# EAGLE design Jerry_microMouse (EAGLE 9.5.2)
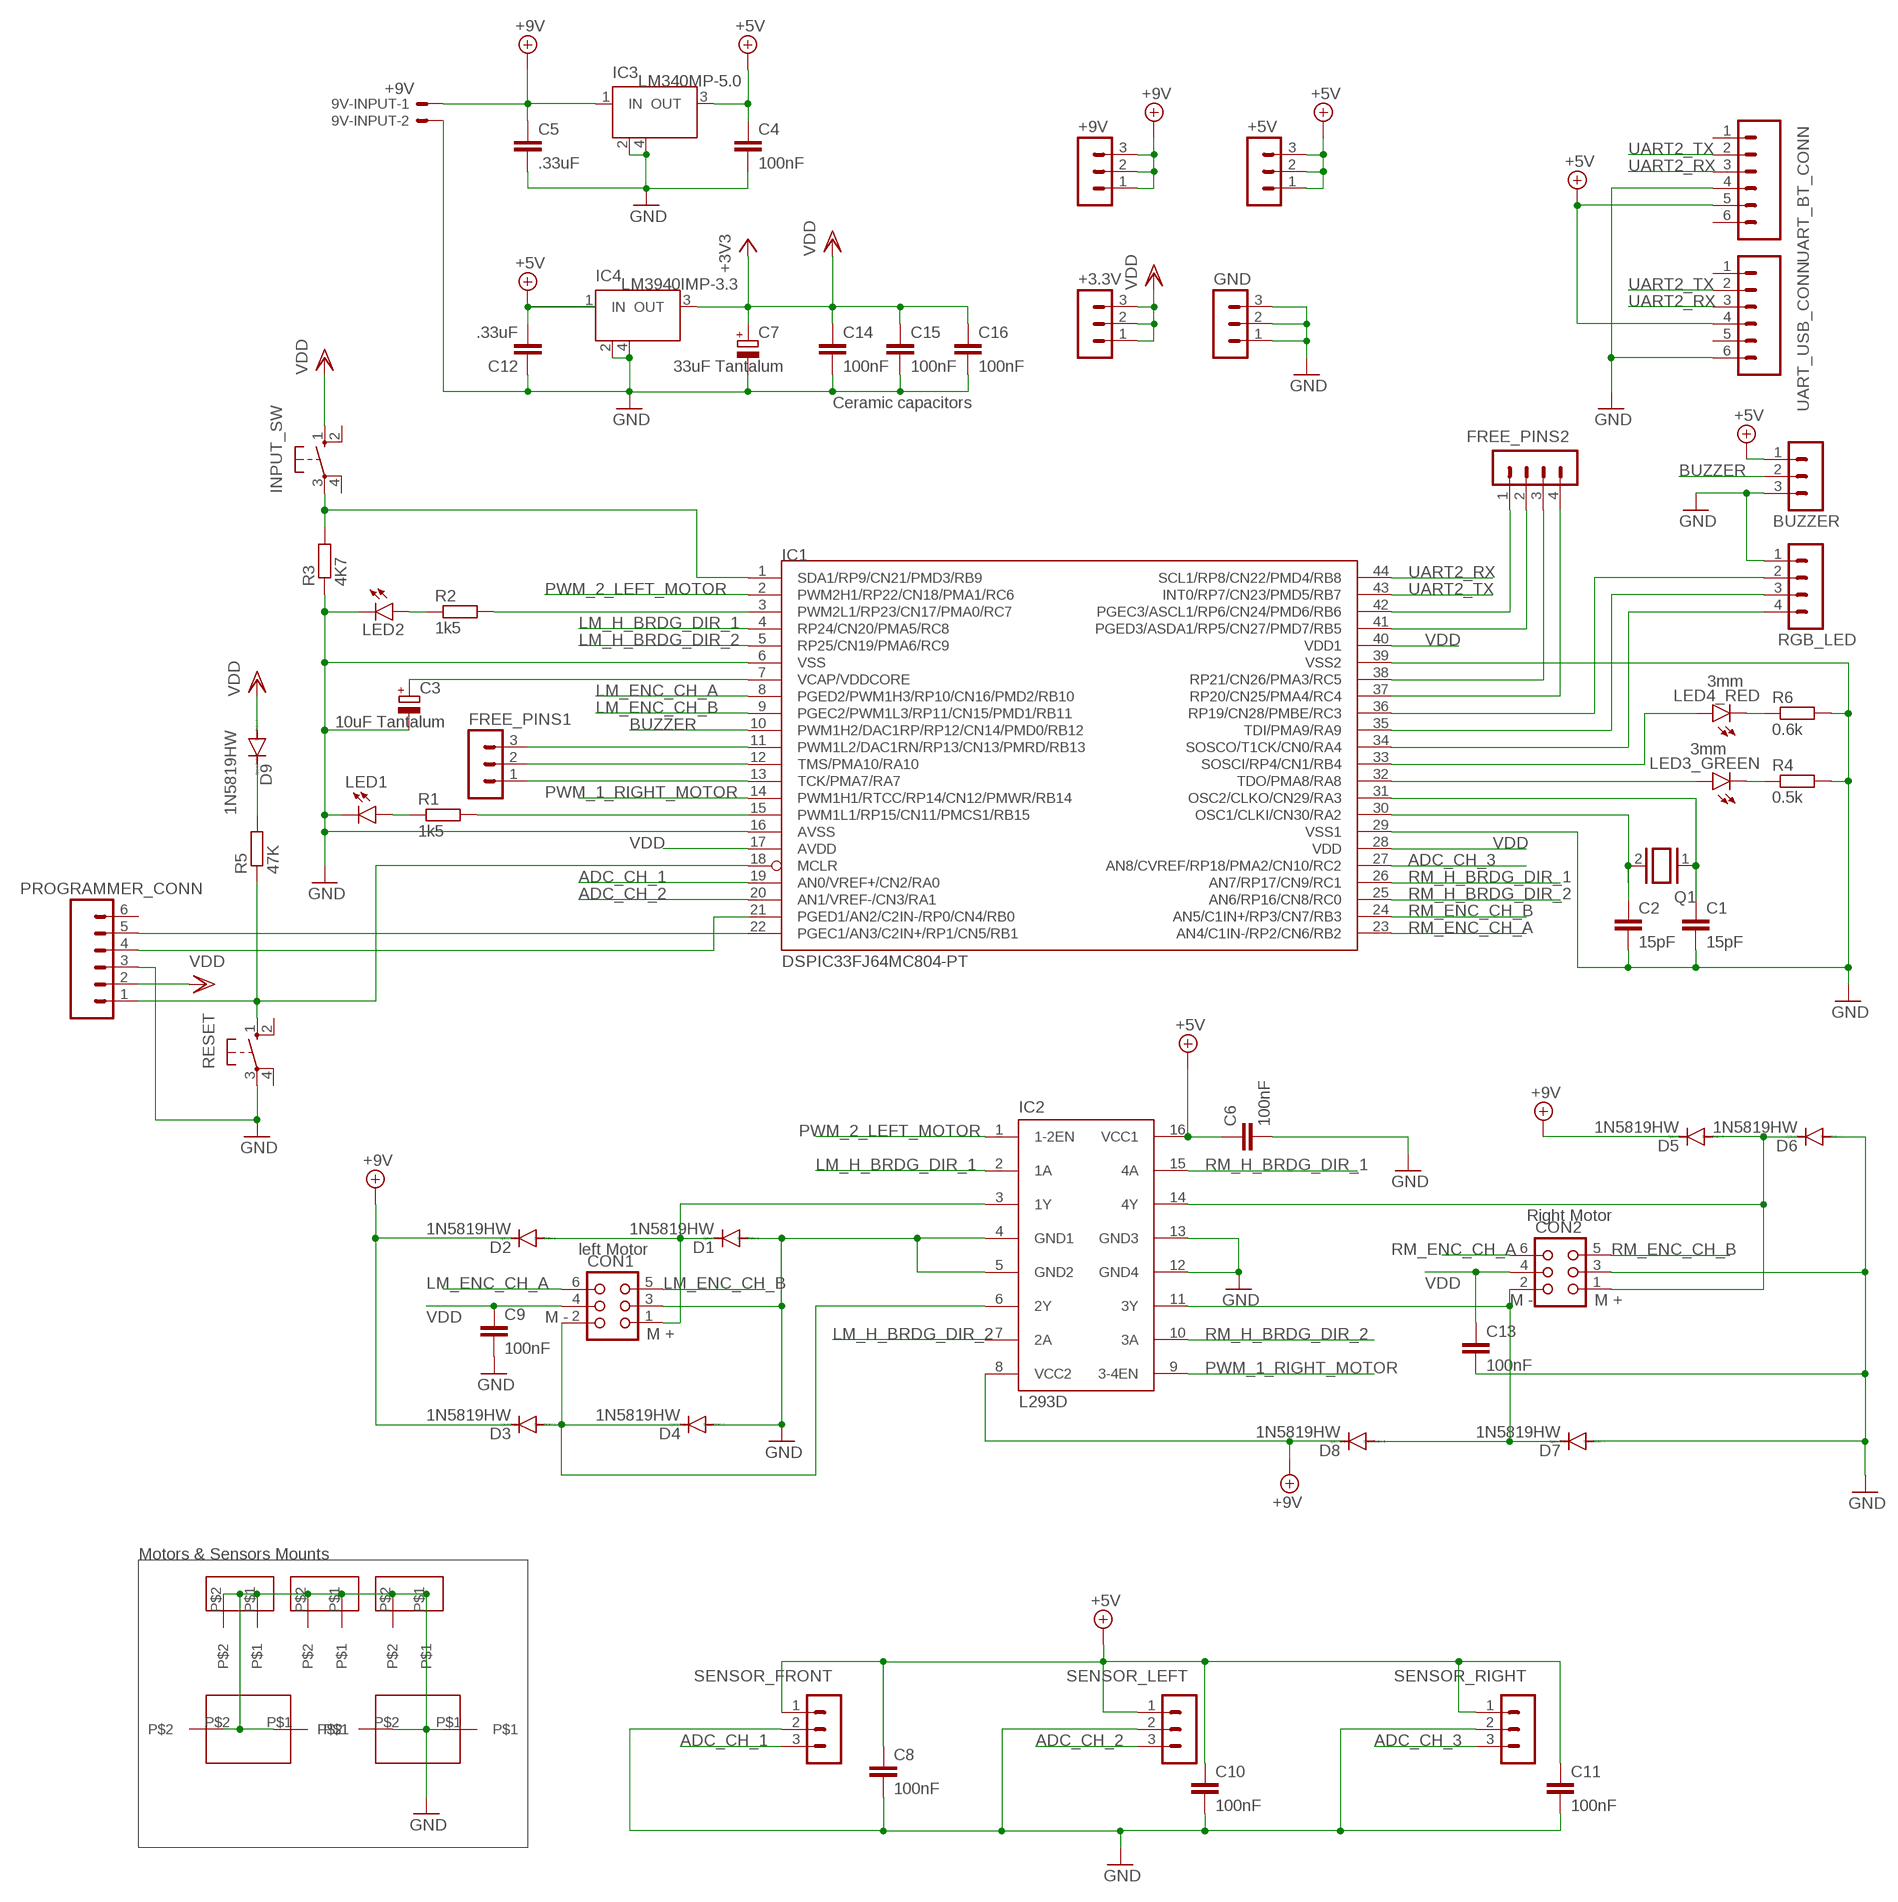
[diagram p0: schematic, sheet 1]

## Parts
9V-INPUT  +9V  22-23-2021  [22-23-2021]
+3.3V  MA03-1  [MA03-1]
+5V  MA03-1  [MA03-1]
+9V  MA03-1  [MA03-1]
BUZZER  MA03-1  [MA03-1]
C1  15pF  C-EUC0805  [C0805]
C2  15pF  C-EUC0805  [C0805]
C3  10uF Tantalum  CPOL-EUCT3216  [CT3216]
C4  100nF  C-EUC0805  [C0805]
C5  .33uF  C-EUC0805  [C0805]
C6  100nF  C-EUC0805  [C0805]
C7  33uF Tantalum  CPOL-EUCT7343  [CT7343]
C8  100nF  C-EUC0805  [C0805]
C9  100nF  C-EUC0805  [C0805]
C10  100nF  C-EUC0805  [C0805]
C11  100nF  C-EUC0805  [C0805]
C12  .33uF  C-EUC0805  [C0805]
C13  100nF  C-EUC0805  [C0805]
C14  100nF  C-EUC0805  [C0805]
C15  100nF  C-EUC0805  [C0805]
C16  100nF  C-EUC0805  [C0805]
CON1  CON06L  [CON06L]
CON2  CON06L  [CON06L]
D1  1N5819HW  CGRM4001-G  [SOD-123_MINI-SMA]
D2  1N5819HW  CGRM4001-G  [SOD-123_MINI-SMA]
D3  1N5819HW  CGRM4001-G  [SOD-123_MINI-SMA]
D4  1N5819HW  CGRM4001-G  [SOD-123_MINI-SMA]
D5  1N5819HW  CGRM4001-G  [SOD-123_MINI-SMA]
D6  1N5819HW  CGRM4001-G  [SOD-123_MINI-SMA]
D7  1N5819HW  CGRM4001-G  [SOD-123_MINI-SMA]
D8  1N5819HW  CGRM4001-G  [SOD-123_MINI-SMA]
D9  1N5819HW  CGRM4001-G  [SOD-123_MINI-SMA]
FREE_PINS1  MA03-1  [MA03-1]
FREE_PINS2  MA04-1  [MA04-1]
GND  MA03-1  [MA03-1]
IC1  DSPIC33FJ64MC804-PT  [TQFP44]
IC2  L293D  [DIL16]
IC3  LM340MP-5.0  LM340S  [SOT223]
IC4  LM3940IMP-3.3  LM340S  [SOT223]
INPUT_SW  10-XX  [B3F-10XX]
LED1  LED5MM  [LED5MM]
LED2  LED5MM  [LED5MM]
LED3_GREEN  3mm  LEDB155  [Q62902-B155]
LED4_RED  3mm  LEDB155  [Q62902-B155]
PROGRAMMER_CONN  M06  [06P]
Q1  XTAL/S  [QS]
R1  1k5  R-EU_R0805  [R0805]
R2  1k5  R-EU_R0805  [R0805]
R3  4K7  R-EU_R0805  [R0805]
R4  0.5k  R-EU_R0805  [R0805]
R5  47K  R-EU_R0805  [R0805]
R6  0.6k  R-EU_R0805  [R0805]
RESET  10-XX  [B3F-10XX]
RGB_LED  MA04-1  [MA04-1]
SENS_MNT_F  SENSOR_MOUNT_F  SENSOR_MOUNT  [SENSOR_MOUNT]
SENS_MNT_L  SENSOR_MOUNT_L  SENSOR_MOUNT  [SENSOR_MOUNT]
SENS_MNT_R  SENSOR_MOUNT_R  SENSOR_MOUNT  [SENSOR_MOUNT]
SENSOR_FRONT  MA03-1  [MA03-1]
SENSOR_LEFT  MA03-1  [MA03-1]
SENSOR_RIGHT  MA03-1  [MA03-1]
U$1  MOTOR_MOUNT  [MOTOR_MOUNT]
U$2  MOTOR_MOUNT  [MOTOR_MOUNT]
UART_BT_CONN  M06  [06P]
UART_USB_CONN  M06  [06P]

## Nets
+5V: +5V.1 +5V.2 +5V.3 BUZZER.1 C4.1 C6.1 C8.1 C10.1 C11.1 C12.2 IC2.16(VCC1) IC3.3(OUT) IC4.1(IN) SENSOR_FRONT.1 SENSOR_LEFT.1 SENSOR_RIGHT.1 UART_BT_CONN.5 UART_USB_CONN.4
+9V: 9V-INPUT.1 +9V.1 +9V.2 +9V.3 C5.1 D2.C D3.C D5.C D8.C IC2.8(VCC2) IC3.1(IN)
ADC_CH_1: IC1.19(AN0/VREF+/CN2/RA0) SENSOR_FRONT.3
ADC_CH_2: IC1.20(AN1/VREF-/CN3/RA1) SENSOR_LEFT.3
ADC_CH_3: IC1.27(AN8/CVREF/RP18/PMA2/CN10/RC2) SENSOR_RIGHT.3
BUZZER: BUZZER.2 IC1.10(PWM1H2/DAC1RP/RP12/CN14/PMD0/RB12)
GND: 9V-INPUT.2 BUZZER.3 C1.2 C2.2 C3.- C4.2 C5.2 C6.2 C7.- C8.2 C9.2 C10.2 C11.2 C12.1 C13.2 C14.2 C15.2 C16.2 CON1.3 CON2.3 D1.A D4.A D6.A D7.A GND.1 GND.2 GND.3 IC1.6(VSS) IC1.16(AVSS) IC1.29(VSS1) IC1.39(VSS2) IC2.4(GND1) IC2.5(GND2) IC2.12(GND4) IC2.13(GND3) IC3.2(GND) IC3.4(GND) IC4.2(GND) IC4.4(GND) LED1.K(C) LED2.K(C) PROGRAMMER_CONN.3 R3.1 R4.2 R6.2 RESET.3(P) RGB_LED.1 SENS_MNT_F.P$1 SENS_MNT_F.P$2 SENS_MNT_L.P$1 SENS_MNT_L.P$2 SENS_MNT_R.P$1 SENS_MNT_R.P$2 SENSOR_FRONT.2 SENSOR_LEFT.2 SENSOR_RIGHT.2 U$1.P$1 U$1.P$2 U$2.P$1 U$2.P$2 UART_BT_CONN.4 UART_USB_CONN.6
LM_ENC_CH_A: CON1.6 IC1.8(PGED2/PWM1H3/RP10/CN16/PMD2/RB10)
LM_ENC_CH_B: CON1.5 IC1.9(PGEC2/PWM1L3/RP11/CN15/PMD1/RB11)
LM_H_BRDG_DIR_1: IC1.4(RP24/CN20/PMA5/RC8) IC2.2(1A)
LM_H_BRDG_DIR_2: IC1.5(RP25/CN19/PMA6/RC9) IC2.7(2A)
LM_M+: CON1.1 D1.C D2.A IC2.3(1Y)
LM_M-: CON1.2 D3.A D4.C IC2.6(2Y)
N$1: IC1.3(PWM2L1/RP23/CN17/PMA0/RC7) R2.2
N$3: LED2.A R2.1
N$5: IC1.22(PGEC1/AN3/C2IN+/RP1/CN5/RB1) PROGRAMMER_CONN.5
N$8: IC1.1(SDA1/RP9/CN21/PMD3/RB9) INPUT_SW.3(P) R3.2
N$9: IC1.32(TDO/PMA8/RA8) LED3_GREEN.A
N$10: C2.1 IC1.30(OSC1/CLKI/CN30/RA2) Q1.2
N$11: C1.1 IC1.31(OSC2/CLKO/CN29/RA3) Q1.1
N$12: IC1.21(PGED1/AN2/C2IN-/RP0/CN4/RB0) PROGRAMMER_CONN.4
N$13: LED3_GREEN.K(C) R4.1
N$14: IC1.15(PWM1L1/RP15/CN11/PMCS1/RB15) R1.2
N$15: IC1.33(SOSCI/RP4/CN1/RB4) LED4_RED.A
N$16: IC1.34(SOSCO/T1CK/CN0/RA4) RGB_LED.4
N$17: LED1.A R1.1
N$18: IC1.35(TDI/PMA9/RA9) RGB_LED.3
N$19: D9.C R5.2
N$20: IC1.36(RP19/CN28/PMBE/RC3) RGB_LED.2
N$21: FREE_PINS1.3 IC1.11(PWM1L2/DAC1RN/RP13/CN13/PMRD/RB13)
N$22: FREE_PINS2.1 IC1.42(PGEC3/ASCL1/RP6/CN24/PMD6/RB6)
N$23: FREE_PINS2.2 IC1.41(PGED3/ASDA1/RP5/CN27/PMD7/RB5)
N$24: FREE_PINS2.3 IC1.38(RP21/CN26/PMA3/RC5)
N$25: LED4_RED.K(C) R6.1
N$26: FREE_PINS2.4 IC1.37(RP20/CN25/PMA4/RC4)
N$27: FREE_PINS1.2 IC1.12(TMS/PMA10/RA10)
N$28: FREE_PINS1.1 IC1.13(TCK/PMA7/RA7)
PWM_1_RIGHT_MOTOR: IC1.14(PWM1H1/RTCC/RP14/CN12/PMWR/RB14) IC2.9(3-4EN)
PWM_2_LEFT_MOTOR: IC1.2(PWM2H1/RP22/CN18/PMA1/RC6) IC2.1(1-2EN)
RESET: IC1.18(MCLR) PROGRAMMER_CONN.1 R5.1 RESET.1(S)
RM_ENC_CH_A: CON2.6 IC1.23(AN4/C1IN-/RP2/CN6/RB2)
RM_ENC_CH_B: CON2.5 IC1.24(AN5/C1IN+/RP3/CN7/RB3)
RM_H_BRDG_DIR_1: IC1.26(AN7/RP17/CN9/RC1) IC2.15(4A)
RM_H_BRDG_DIR_2: IC1.25(AN6/RP16/CN8/RC0) IC2.10(3A)
RM_M+: CON2.1 D5.A D6.C IC2.14(4Y)
RM_M-: CON2.2 D7.C D8.A IC2.11(3Y)
UART2_RX: IC1.44(SCL1/RP8/CN22/PMD4/RB8) UART_BT_CONN.3 UART_USB_CONN.3
UART2_TX: IC1.43(INT0/RP7/CN23/PMD5/RB7) UART_BT_CONN.2 UART_USB_CONN.2
VCAP/VDDCORE: C3.+ IC1.7(VCAP/VDDCORE)
VDD: +3.3V.1 +3.3V.2 +3.3V.3 C7.+ C9.1 C13.1 C14.1 C15.1 C16.1 CON1.4 CON2.4 D9.A IC1.17(AVDD) IC1.28(VDD) IC1.40(VDD1) IC4.3(OUT) INPUT_SW.1(S) PROGRAMMER_CONN.2 ; supply symbol labelled +3V3
Unconnected: INPUT_SW.2(S1) INPUT_SW.4(P1) PROGRAMMER_CONN.6 RESET.2(S1) RESET.4(P1) UART_BT_CONN.1 UART_BT_CONN.6 UART_USB_CONN.1 UART_USB_CONN.5

## Notes on the sheet
- Ceramic capacitors
- Right Motor
- left Motor
- M - | M +
- M -
- M +
- Motors & Sensors Mounts

## Library data of the parts
9V-INPUT = con-molex:22-23-2021: .100" (2.54mm) Center Header - 2 Pin; MF: MOLEX; MPN: 22-23-2021; OC_FARNELL: 1462926; OC_NEWARK: 25C3832
+3.3V +5V +9V BUZZER FREE_PINS1 GND SENSOR_FRONT SENSOR_LEFT SENSOR_RIGHT = con-lstb:MA03-1: PIN HEADER; OC_FARNELL: unknown; OC_NEWARK: unknown
C1 C2 C4-C6 C8-C16 = rcl:C-EU: CAPACITOR, European symbol; SPICEPREFIX: C
C3 C7 = rcl:CPOL-EU: POLARIZED CAPACITOR, European symbol; SPICEPREFIX: C
CON1 CON2 = con-harting:CON06L: CONNECTOR; OC_FARNELL: unknown; OC_NEWARK: unknown
D1-D9 = diode:CGRM400*-G: Molded plasitc,JEDEC SOD-123/Mini SMA Source: Comchip CGRM4001-G.pdf
FREE_PINS2 RGB_LED = con-lstb:MA04-1: PIN HEADER; OC_FARNELL: unknown; OC_NEWARK: unknown
IC1 = microchip-dspic33fjxxmc:DSPIC33FJ64MC804: dsPIC33FJ32MC302/304, dsPIC33FJ64MCX02/X04, AND dsPIC33FJ128MCX02/X04 High-Performance, 16-bit Digital Signal Controllers Package:44 Pin TQFP Operating Range: * Up to 40 MIPS operation (at 3.0V -3.6V): - Industrial temperature range (-40°C to +85°C) - Extended temperature range (-40°C to +125°C) High-Performance DSC CPU: * Modified Harvard architecture * C compiler optimized instruction set * 16-bit wide data path * 24-bit wide instructions * Linear program memory addressing up to 4M instruction words * Linear data memory addressing up to 64 Kbytes * 83 base instructions: mostly 1 word/1 cycle * Two 40-bit accumulators with rounding and saturation options * Flexible and powerful addressing modes: - Indirect - Modulo - Bit-Reversed * Software stack * 16 x 16 fractional/integer multiply operations * 32/16 and 16/16 divide operations * Single-cycle multiply and accumulate: - Accumulator write back for DSP operations - Dual data fetch * Up to ±16-bit shifts for up to 40-bit data Direct Memory Access (DMA): * 8-channel hardware DMA * Up to 2 Kbytes dual ported DMA buffer area (DMA RAM) to store data transferred via DMA: - Allows data transfer between RAM and a peripheral while CPU is executing code (no cycle stealing) * Most peripherals support DMA Timers/Capture/Compare/PWM: * Timer/Counters, up to five 16-bit timers: - Can pair up to make two 32-bit timers - One timer runs as a Real-Time Clock with an external 32.768 kHz oscillator - Programmable prescaler * Input Capture (up to four channels): - Capture on up, down or both edges - 16-bit capture input functions - 4-deep FIFO on each capture * Output Compare (up to four channels): - Single or Dual 16-bit Compare mode - 16-bit Glitchless PWM mode * Hardware Real-Time Clock/Calendar (RTCC): - Provides clock, calendar, and alarm functions Interrupt Controller: * 5-cycle latency * Up to 53 available interrupt sources * Up to three external interrupts * Seven programmable priority levels * Five processor exceptions Digital I/O: * Peripheral pin Select functionality * Up to 35 programmable digital I/O pins * Wake-up/Interrupt-on-Change for up to 31 pins * Output pins can drive from 3.0V to 3.6V * Up to 5V output with open drain configuration * All digital input pins are 5V tolerant * 4 mA sink on all I/O pins On-Chip Flash and SRAM: * Flash program memory (up to 128 Kbytes) * Data SRAM (up to 16 Kbytes) * Boot, Secure, and General Security for program Flash System Management: * Flexible clock options: - External, crystal, resonator, internal RC - Fully integrated Phase-Locked Loop (PLL) - Extremely low jitter PLL * Power-up Timer * Oscillator Start-up Timer/Stabilizer * Watchdog Timer with its own RC oscillator * Fail-Safe Clock Monitor * Reset by multiple sources Power Management: * On-chip 2.5V voltage regulator * Switch between clock sources in real time * Idle, Sleep, and Doze modes with fast wake-up Analog-to-Digital Converters (ADCs): * 10-bit, 1.1 Msps or 12-bit, 500 Ksps conversion: - Two and four simultaneous samples (10-bit ADC) - Up to nine input channels with auto-scanning - Conversion start can be manual or synchronized with one of four trigger sources - Conversion possible in Sleep mode - ±2 LSb max integral nonlinearity - ±1 LSb max differential nonlinearity Audio Digital-to-Analog Converter (DAC): - 16-bit Dual Channel DAC module - 100 Ksps maximum sampling rate - Second-Order Digital Delta-Sigma Modulator Comparator Module: * Two analog comparators with programmable input/output configuration CMOS Flash Technology: * Low-power, high-speed Flash technology * Fully static design * 3.3V (±10%) operating voltage * Industrial and Extended temperature * Low power consumption Motor Control Peripherals: * 6-channel 16-bit Motor Control PWM: - Three duty cycle generators - Independent or Complementary mode - Programmable dead-time and output polarity - Edge-aligned or center-aligned - Manual output override control - One Fault input - Trigger for ADC conversions - PWM frequency for 16-bit resolution (@ 40 MIPS) = 1220 Hz for Edge-Aligned mode, 610 Hz for Center-Aligned mode - PWM frequency for 11-bit resolution (@ 40 MIPS) = 39.1 kHz for Edge-Aligned mode, 19.55 kHz for Center-Aligned mode * 2-channel 16-bit Motor Control PWM: - One duty cycle generator - Independent or Complementary mode - Programmable dead time and output polarity - Edge-aligned or center-aligned - Manual output override control - One Fault input - Trigger for ADC conversions - PWM frequency for 16-bit resolution (@ 40 MIPS) = 1220 Hz for Edge-Aligned mode, 610 Hz for Center-Aligned mode - PWM frequency for 11-bit resolution (@ 40 MIPS) = 39.1 kHz for Edge-Aligned mode, 19.55 kHz for Center-Aligned mode * 2-Quadrature Encoder Interface module: - Phase A, Phase B, and index pulse input - 16-bit up/down position counter - Count direction status - Position Measurement (x2 and x4) mode - Programmable digital noise filters on inputs - Alternate 16-bit Timer/Counter mode - Interrupt on position counter rollover/underflow
IC2 = st-microelectronics:L293D: PUSH-PULL 4 CHANNEL DRIVER; MPN: L293D; OC_FARNELL: 9589619; OC_NEWARK: 56P8249
IC3 IC4 = linear:LM340S: 3-Terminal Positive Regulators Source: http://cache.national.com/ds/LM/LM340.pdf
INPUT_SW RESET = switch-omron:10-XX: OMRON SWITCH; MPN: B3F-1000; OC_FARNELL: 176432; OC_NEWARK: 36M3542
LED1 LED2 LED3_GREEN LED4_RED = led:LED: LED OSRAM: - CHIPLED LG R971, LG N971, LY N971, LG Q971, LY Q971, LO R971, LY R971 LH N974, LH R974 LS Q976, LO Q976, LY Q976 LO Q996 - Hyper CHIPLED LW Q18S LB Q993, LB Q99A, LB R99A - SideLED LS A670, LO A670, LY A670, LG A670, LP A670 LB A673, LV A673, LT A673, LW A673 LH A674 LY A675 LS A676, LA A676, LO A676, LY A676, LW A676 LS A679, LY A679, LG A679 - Hyper Micro SIDELED® LS Y876, LA Y876, LO Y876, LY Y876 LT Y87S - SmartLED LW L88C, LW L88S LB L89C, LB L89S, LG L890 LS L89K, LO L89K, LY L89K LS L896, LA L896, LO L896, LY L896 - TOPLED LS T670, LO T670, LY T670, LG T670, LP T670 LSG T670, LSP T670, LSY T670, LOP T670, LYG T670 LG T671, LOG T671, LSG T671 LB T673, LV T673, LT T673, LW T673 LH T674 LS T676, LA T676, LO T676, LY T676, LB T676, LH T676, LSB T676, LW T676 LB T67C, LV T67C, LT T67C, LS T67K, LO T67K, LY T67K, LW E67C LS E67B, LA E67B, LO E67B, LY E67B, LB E67C, LV E67C, LT E67C LW T67C LS T679, LY T679, LG T679 LS T770, LO T770, LY T770, LG T770, LP T770 LB T773, LV T773, LT T773, LW T773 LH T774 LS E675, LA E675, LY E675, LS T675 LS T776, LA T776, LO T776, LY T776, LB T776 LHGB T686 LT T68C, LB T68C - Hyper Mini TOPLED® LB M676 - Mini TOPLED Santana® LG M470 LS M47K, LO M47K, LY M47K Source: http://www.osram.convergy.de LUXEON: - LUMILED® LXK2-PW12-R00, LXK2-PW12-S00, LXK2-PW14-U00, LXK2-PW14-V00 LXK2-PM12-R00, LXK2-PM12-S00, LXK2-PM14-U00 LXK2-PE12-Q00, LXK2-PE12-R00, LXK2-PE12-S00, LXK2-PE14-T00, LXK2-PE14-U00 LXK2-PB12-K00, LXK2-PB12-L00, LXK2-PB12-M00, LXK2-PB14-N00, LXK2-PB14-P00, LXK2-PB14-Q00 LXK2-PR12-L00, LXK2-PR12-M00, LXK2-PR14-Q00, LXK2-PR14-R00 LXK2-PD12-Q00, LXK2-PD12-R00, LXK2-PD12-S00 LXK2-PH12-R00, LXK2-PH12-S00 LXK2-PL12-P00, LXK2-PL12-Q00, LXK2-PL12-R00 Source: www.luxeon.com KINGBRIGHT: KA-3528ASYC Source: www.kingbright.com
PROGRAMMER_CONN UART_BT_CONN UART_USB_CONN = con-amp-quick:M06: AMP QUICK CONNECTOR; OC_FARNELL: unknown; OC_NEWARK: unknown
Q1 = special:XTAL/S: CRYSTAL
R1-R6 = rcl:R-EU_: RESISTOR, European symbol; SPICEPREFIX: R
SENS_MNT_F SENS_MNT_L SENS_MNT_R = linear:SENSOR_MOUNT
U$1 U$2 = linear:MOTOR_MOUNT

## Board
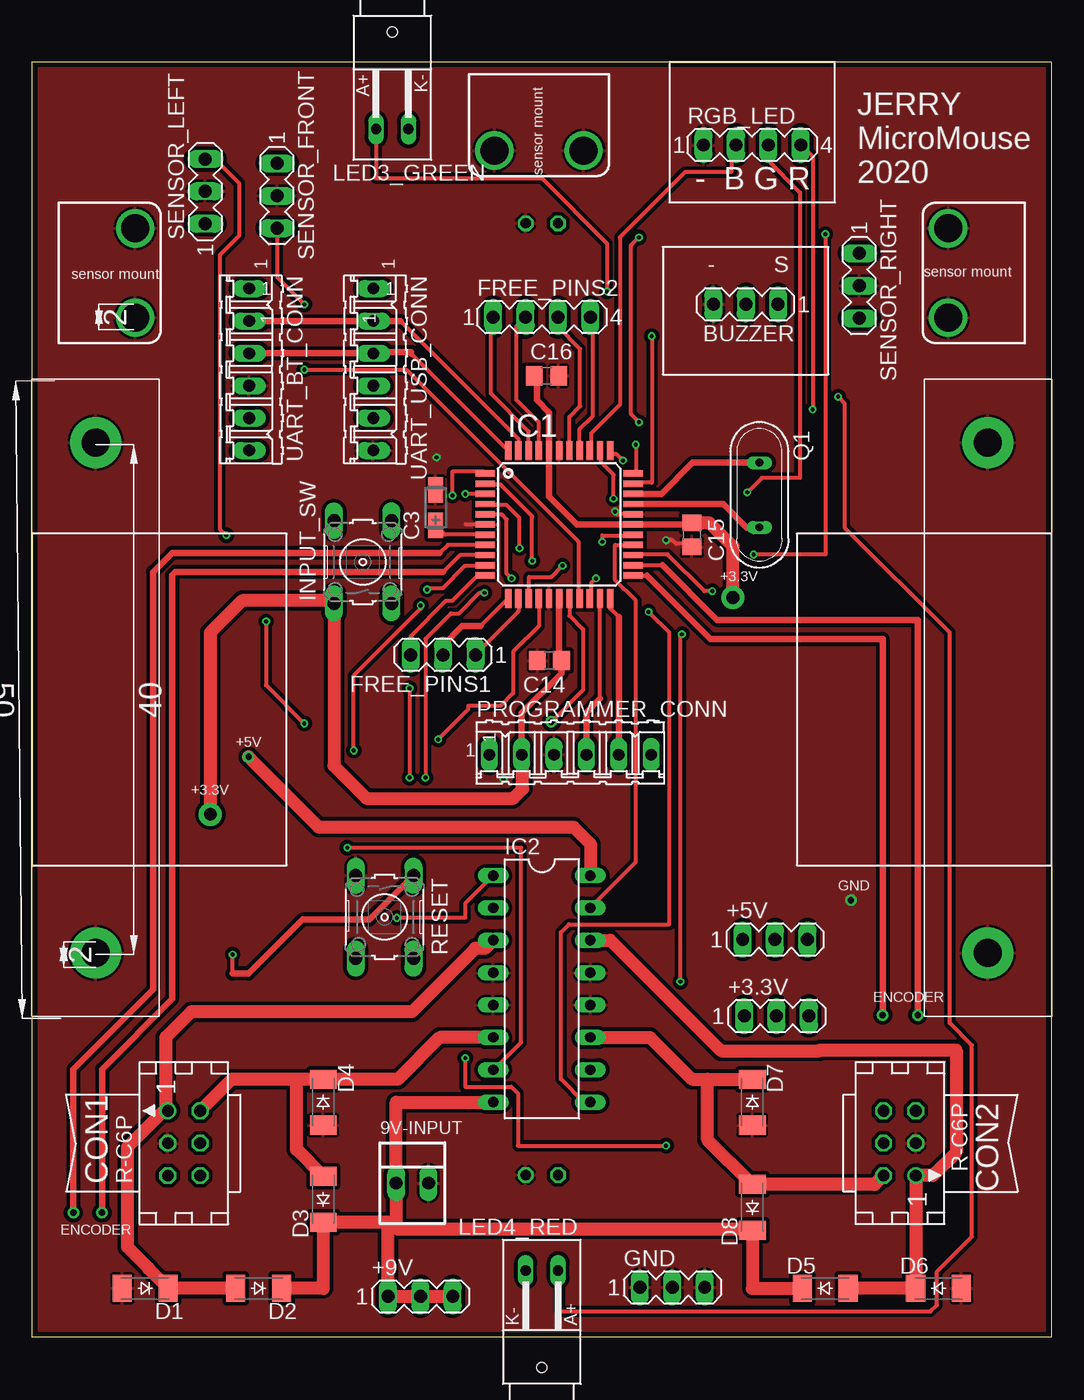
[diagram p1: board, top side]
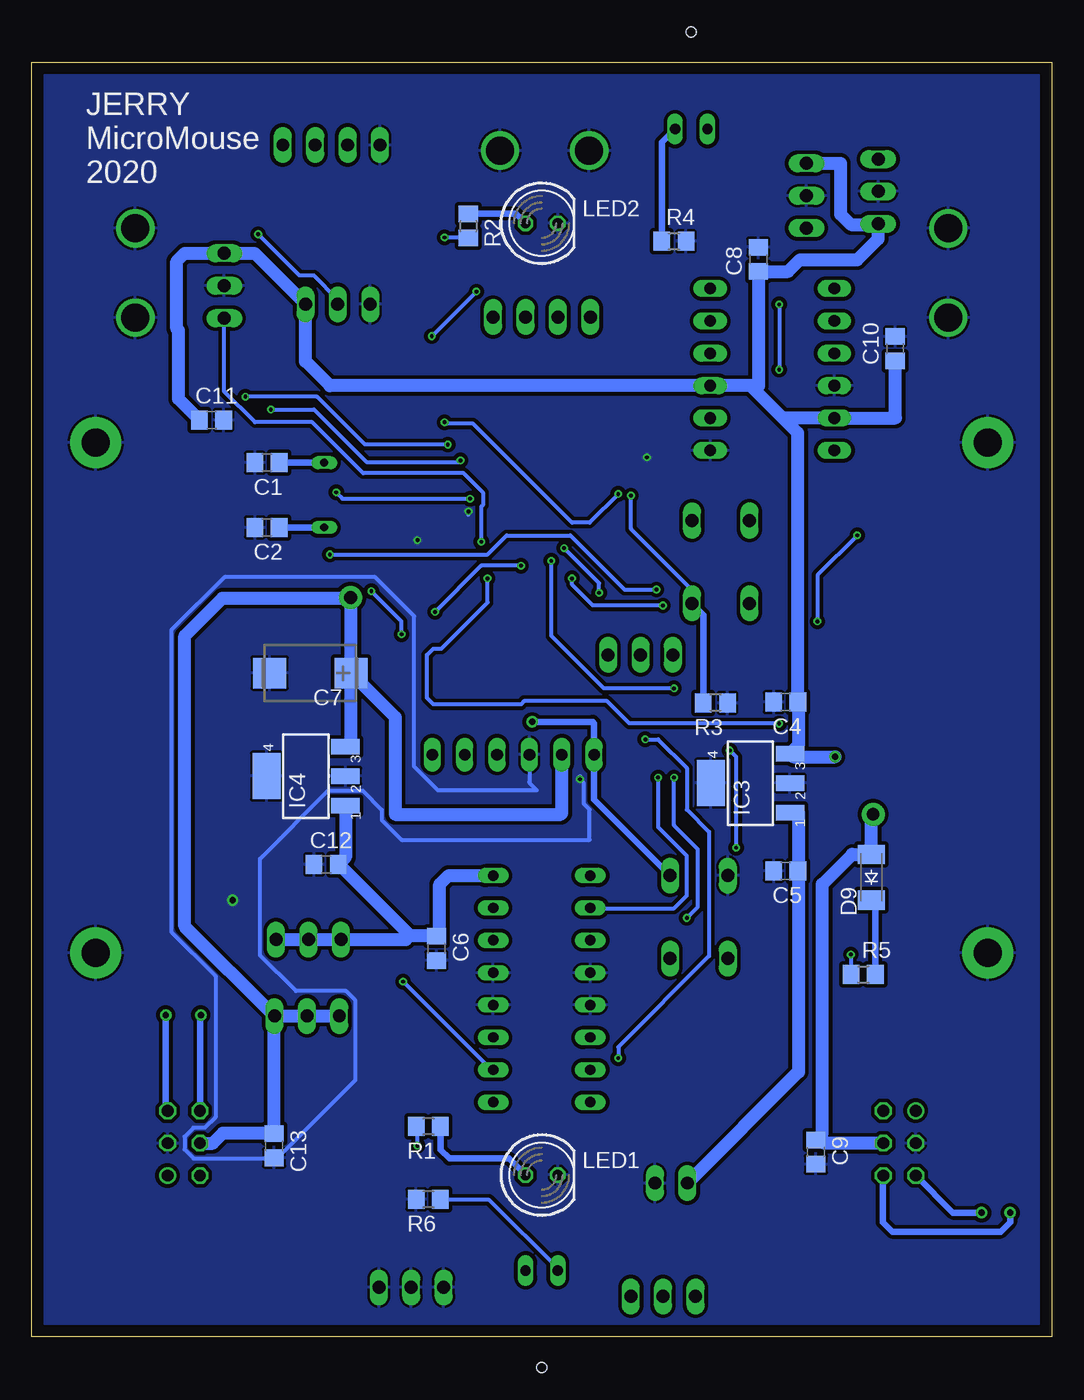
[diagram p2: board, bottom side, seen from below]

Size 80 x 100 mm. Coordinates in mm from the lower left corner, seen from the top.
Outline: 0,0 80,0 80,100 0,100 0,0
Copper layers (1*16): Top 0.035mm / dielectric 1.5mm / Bottom 0.035mm
Design rules "PCB-POOL Standard": minimum track width 0.15mm, minimum drill 0.3mm, track to track 0.15mm, track to pad 0.15mm, pad to pad 0.15mm, via to via 0.15mm, smd to smd 0.15mm, copper to edge 0.3mm, drill to drill 0.2mm, minimum pad ring 0.2mm, minimum via ring 0.15mm, stop-mask expansion 0.03mm, vias tented up to drill 0mil, thermal gap 0.2mm

### Footprints (pad centres in the part's own frame; a part is rotated, then mirrored left to right if it is on the bottom)
22-23-2021 = drill 1 long: 1 -1.27,0; 2 1.27,0
MA03-1 = drill 1.016 long: 1 -2.54,0; 2 0,0; 3 2.54,0
C0805 = smd 1.3 x 1.5: 1 -0.95,0; 2 0.95,0
CT3216 = smd 2 x 1.2: + -1.4,0; - 1.4,0
CT7343 = smd 2.6 x 2.4: + -3.2,0; - 3.2,0
CON06L = drill 0.914: 1 2.54,1.27 | drill 0.914 octagon: 2 2.54,-1.27; 3 0,1.27; 4 0,-1.27; 5 -2.54,1.27; 6 -2.54,-1.27
SOD-123_MINI-SMA = smd 1.5 x 2.1: A 1.8,0; C -1.8,0
MA04-1 = drill 1.016 long: 1 -3.81,0; 2 -1.27,0; 3 1.27,0; 4 3.81,0
TQFP44 = smd 1.5 x 0.5: 1 -5.8,4; 2 -5.8,3.2; 3 -5.8,2.4; 4 -5.8,1.6; 5 -5.8,0.8; 6 -5.8,0; 7 -5.8,-0.8; 8 -5.8,-1.6; 9 -5.8,-2.4; 10 -5.8,-3.2; 11 -5.8,-4; 23 5.8,-4; 24 5.8,-3.2; 25 5.8,-2.4; 26 5.8,-1.6; 27 5.8,-0.8; 28 5.8,0; 29 5.8,0.8; 30 5.8,1.6; 31 5.8,2.4; 32 5.8,3.2; 33 5.8,4 | smd 0.5 x 1.5: 12 -4,-5.8; 13 -3.2,-5.8; 14 -2.4,-5.8; 15 -1.6,-5.8; 16 -0.8,-5.8; 17 0,-5.8; 18 0.8,-5.8; 19 1.6,-5.8; 20 2.4,-5.8; 21 3.2,-5.8; 22 4,-5.8; 34 4,5.8; 35 3.2,5.8; 36 2.4,5.8; 37 1.6,5.8; 38 0.8,5.8; 39 0,5.8; 40 -0.8,5.8; 41 -1.6,5.8; 42 -2.4,5.8; 43 -3.2,5.8; 44 -4,5.8
DIL16 = drill 0.813 long: 1 -8.89,-3.81; 2 -6.35,-3.81; 3 -3.81,-3.81; 4 -1.27,-3.81; 5 1.27,-3.81; 6 3.81,-3.81; 7 6.35,-3.81; 8 8.89,-3.81; 9 8.89,3.81; 10 6.35,3.81; 11 3.81,3.81; 12 1.27,3.81; 13 -1.27,3.81; 14 -3.81,3.81; 15 -6.35,3.81; 16 -8.89,3.81
SOT223 = smd 1.219 x 2.235: 1 -2.311,-3.099; 2 0,-3.099; 3 2.311,-3.099 | smd 3.6 x 2.2: 4 0,3.099
B3F-10XX = drill 1.016 long: 1 -3.251,2.261; 2 3.251,2.261; 3 -3.251,-2.261; 4 3.251,-2.261
LED5MM = drill 0.813 octagon: A -1.27,0; K 1.27,0
Q62902-B155 = drill 0.813 long: A 7.62,-1.27; K 7.62,1.27 | hole 0.813: 0,0
06P = drill 0.914 long: 1 -6.35,0; 2 -3.81,0; 3 -1.27,0; 4 1.27,0; 5 3.81,0; 6 6.35,0
QS = drill 0.61 long: 1 -2.54,0; 2 2.54,0
R0805 = smd 1.3 x 1.5: 1 -0.95,0; 2 0.95,0
SENSOR_MOUNT = drill 2.2 pad 3: P$1 6,2; P$2 6,9
MOTOR_MOUNT = drill 2.2 pad 4: P$1 -19.86,0; P$2 20.14,0

### Placement (x,y rotation side)
9V-INPUT  29.84,12.06 0 top
+3.3V  58.42,25.17 0 top
+5V  58.3,31.18 0 top
+9V  30.48,3.17 0 top
BUZZER  56,81 180 top
C1  61.55,68.58 180 bottom
C2  61.55,63.5 180 bottom
C3  31.68,65.06 90 top
C4  20.86,49.8 180 bottom
C5  20.86,36.56 180 bottom
C6  48.26,30.48 270 bottom
C7  58.15,52.07 180 bottom
C8  23.02,84.53 90 bottom
C9  18.5,14.5 270 bottom
C10  12.28,77.53 90 bottom
C11  65.91,71.93 0 bottom
C12  56.92,37.06 0 bottom
C13  61,15 270 bottom
C14  40.6,53.07 180 top
C15  51.78,62.92 270 top
C16  40.37,75.39 0 top
CON1  11.93,15.2 90 top
CON2  68.08,15.2 270 top
D1  8.89,3.81 180 top
D2  17.78,3.81 180 top
D3  22.86,10.79 90 top
D4  22.86,18.41 270 top
D5  62.23,3.81 0 top
D6  71.12,3.81 0 top
D7  56.52,18.41 270 top
D8  56.52,10.16 90 top
D9  14.14,36.06 90 bottom
FREE_PINS1  32.25,53.5 180 top
FREE_PINS2  40,80 0 top
GND  50.24,3.88 0 top
IC1  41.37,63.73 0 top
IC2  40.01,27.3 270 top
IC3  23.63,43.45 90 bottom
IC4  58.5,44 90 bottom
INPUT_SW  25.95,60.78 90 top
LED1  40.01,12.7 0 bottom
LED2  40.01,87.36 0 bottom
LED3_GREEN  28.27,102.37 270 top
LED4_RED  40.01,-2.4 90 top
PROGRAMMER_CONN  42.23,45.68 0 top
Q1  57.07,66.04 270 top
R1  48.9,16.51 180 bottom
R2  45.77,87.14 270 bottom
R3  26.38,49.74 180 bottom
R4  29.63,85.94 0 bottom
R5  14.78,28.44 0 bottom
R6  48.9,10.79 180 bottom
RESET  27.67,32.94 270 top
RGB_LED  56.5,93.5 0 top
SENS_MNT_F  77.88,88.96 180 top
SENS_MNT_L  34.28,99.06 270 top
SENS_MNT_R  2.11,77.96 0 top
SENSOR_FRONT  19.23,89.52 270 top
SENSOR_LEFT  13.61,89.86 90 top
SENSOR_RIGHT  64.91,82.45 270 top
U$1  5,50 90 top
U$2  75,50 90 top
UART_BT_CONN  17.05,75.89 270 top
UART_USB_CONN  26.79,75.89 270 top

### Tracks (layer width: path | path; a pad name or v marks a point on that pad's centre or on a via)
+5V  (via drill 0.5)
  Top 1.016: v17,45.5 22.5,40 42.5,40 43.81,38.69 IC2.16
  Bottom 0.3: C6.1 48.38,31.5 48,31.75 | 19.85,49.38 19.88,49.38 C4.1 | C12.2 56,37.12 55.91,37.06 | C8.1 23.12,83.62 23,83.52
  Bottom 1.016: 19.85,49.38 19.85,46.44 IC3.3 20.27,45.5 v17,45.5 | C4.1 19.91,70.91 21.08,72.08 | 23.62,74.62 23,74.62 23,83.52 | 23.62,74.62 UART_USB_CONN.4 56.62,74.62 58.54,76.54 BUZZER.1 62.53,85 SENSOR_RIGHT.1 68,85 68.63,84.37 68.63,79.08 68.5,78.95 68.5,73.58 C11.1 | 21.08,72.08 23.62,74.62 | 21.08,72.08 UART_BT_CONN.5 12.25,72.08 12.25,76.55 C10.1 | SENSOR_FRONT.1 16.56,92.06 16.56,88.06 15.75,87.25 13.68,87.25 SENSOR_LEFT.1 13.61,86.14 15.25,84.5 19.75,84.5 20.68,83.58 C8.1 | IC4.1 55.4,37.63 55.91,37.12 55.91,37.06 50.34,31.49 | 50.34,31.49 48.26,31.49 48,31.75 48,35.5 47.3,36.2 IC2.16 | +5V.3 +5V.2 +5V.1 50.65,31.18 50.34,31.49
+9V
  Top 0.3: 30.5,3.17 30.5,3.25 +9V.2
  Top 1.016: 9V-INPUT.1 28.57,18.41 IC2.8 | 9V-INPUT.1 28.57,8.99 27.94,8.99 | 27.94,8.99 D3.C 22.86,3.81 D2.C | 27.94,8.99 +9V.1 +9V.2 30.5,3.17 +9V.3 | 9V-INPUT.1 28.57,8.5 56.52,8.5 D8.C 56.52,3.81 D5.C
  Bottom 0.3: C5.1 20,36.62 19.85,36.62
  Bottom 1.016: IC3.1 19.85,41.14 19.85,36.62 19.85,20.79 9V-INPUT.1
ADC_CH_1  (via drill 0.3)
  Top 0.3: v21.38,75.88 29.38,75.88 42.88,62.38 42.88,58 IC1.19 | v21.38,81 19.25,83.12 19.25,86.88 SENSOR_FRONT.3
  Bottom 0.3: v21.38,81 v21.38,75.88
ADC_CH_2  (via drill 0.3)
  Top 0.3: v44.25,59.5 43.88,59.12 43.88,58 IC1.20 | v21.38,48.12 18.38,51.12 v18.38,56.12 | v15.25,62.88 14.75,63.38 14.75,84.88 16.25,86.38 16.25,90.5 14.25,92.5 13.71,92.5 SENSOR_LEFT.3
  Bottom 0.3: v44.25,59.5 44.25,57.62 47.88,54 48.5,54 49,53.5 49,50.12 48.5,49.62 41.62,49.62 41.38,49.88 34.88,49.88 33.12,48.12 v21.38,48.12 | v18.38,56.12 18.38,59.75 v15.25,62.88
ADC_CH_3  (via drill 0.3)
  Top 0.3: v44.75,62.38 44.75,62.88 47.12,62.88 IC1.27
  Bottom 0.3: v44.75,62.38 44.75,65.12 44.62,65.25 44.62,66.25 46.12,67.75 54,67.75 58,71.75 62.5,71.75 64.91,74.16 SENSOR_RIGHT.3
BUZZER  (via drill 0.3)
  Top 0.3: v31,58.62 31,58.75 32.25,58.75 34,60.5 35.5,60.5 IC1.10 | v56.62,61.38 62.25,61.38 v62.25,86.5
  Bottom 0.3: v31,58.62 33.5,58.62 37.75,62.88 42.75,62.88 44.25,61.38 v56.62,61.38 | v62.25,86.5 59,83.25 57.88,83.25 56,81.38 BUZZER.2
GND  (via drill 0.3, 0.5)
  Top 0.3: C14.2 39.75,53.12 39.73,53.15 | IC1.29 45.97,64.53 v45.75,64.75 | C3.- 31.68,66.08
  Top 0.305: IC1.6 34.02,63.73 | C15.2 51.53,62.22 50.53,62.22 50.25,62.5 v49.75,62.5
  Bottom 0.3: 37,44 37.12,43.88 v37,43.75 36.69,43.44 36.69,41.81 36.25,41.37 36.25,39 51,39 52.56,40.56 52.56,41.35 54.06,42.85 56.75,42.85 62.1,37.5 62.1,29.95 59.29,27.14 55.36,27.14 54.62,26.4 54.62,20.15 60.78,13.99 67.31,13.99 68.02,14.7 68.02,15.7 67.31,16.41 66.44,16.41 65.6,17.24 65.6,28.31 69.06,31.77 69.06,55.44 64.9,59.6 53.06,59.6 50,56.54 50,44.73 48.14,42.88 40.38,42.88 41,43.5 40.97,43.53 PROGRAMMER_CONN.3
  Bottom 0.305: v45.75,64.75 45.75,64.5
  other vias: 31.75,69 64.25,34.25
  pour Bottom (isolate 0.3): 1,1 79,1 79,99 1,99
  pour Top (isolate 0.3): 0.5,0.5 79.5,0.5 79.5,99.5 0.5,99.5
LM_ENC_CH_A  (via drill 0.5)
  Top 0.3: IC1.8 32.63,62.13 32,61.5
  Top 0.508: 32,61.5 11,61.5 9.5,60 9.5,27.25 3.25,21 v3.25,9.75
  Bottom 0.508: v3.25,9.75 3.25,9 4,8.25 12.5,8.25 13.25,9 13.25,12.61 CON1.6
LM_ENC_CH_B  (via drill 0.5)
  Top 0.3: IC1.9 33.58,61.33 32.25,60
  Top 0.508: 32.25,60 11.25,60 11,59.75 11,26.5 5.5,21 v5.5,9.75
  Bottom 0.508: CON1.5 7.75,9.75 v5.5,9.75
LM_H_BRDG_DIR_1  (via drill 0.3)
  Top 0.3: v38.25,61.88 38.25,64.25 37.25,65.25 35.62,65.25 IC1.4 | v35.5,58.38 35.12,58.38 33.5,56.75 32.88,56.75 30.88,54.75 v30.88,43.88
  Bottom 0.3: v38.25,61.88 35.5,59.12 v35.5,58.38 | v30.88,43.88 30.88,40 28.62,37.75 28.62,34.62 29.62,33.62 36.12,33.62 IC2.2
LM_H_BRDG_DIR_2  (via drill 0.3)
  Top 0.3: v37.62,59.5 37.25,59.88 37.25,64.12 36.88,64.5 35.62,64.5 IC1.5 | v30.5,57.38 30.5,57.12 25.25,51.88 v25.25,46 | v24.75,38.38 38.38,38.38 38.38,23.12 36.25,21 IC2.7
  Bottom 0.3: v37.62,59.5 37.62,59 36,57.38 v30.5,57.38 | v25.25,46 24.75,45.5 v24.75,38.38
LM_M+
  Top 1.016: IC2.3 35.57,30.49 34.8,30.49 29.81,25.5 12.5,25.5 10.5,23.5 10.5,17.9 | 10.5,17.9 CON1.1 | D2.A D1.C 9.15,5.35 9.15,5.4 7.5,7.05 7.5,14.9 10.5,17.9
LM_M-
  Top 0.3: 21.12,20.21 21.12,14.25 22.75,12.62 D3.A
  Top 1.016: IC2.6 32,23.5 28.71,20.21 D4.C 21.12,20.21 20.75,20.21 | 20.75,20.21 15.68,20.21 CON1.2 | D3.A 20.75,14.71 20.75,20.21
N$1  (via drill 0.3)
  Top 0.3: v47.62,86.25 47,85.62 47,72.38 v47.62,71.75 | v34,66.12 35.5,66.12 IC1.3
  Bottom 0.3: v47.62,86.25 45.88,86.25 R2.2 | v47.62,71.75 47.5,71.62 45.38,71.62 37.62,63.88 36.25,63.88 v34,66.12
N$3
  Bottom 0.508: LED2.A 42.01,88.09 R2.1
N$5
  Top 0.3: IC1.22 45.37,57.13 46.05,56.45
  Top 0.508: PROGRAMMER_CONN.5 46.05,56.45
N$8  (via drill 0.3)
  Top 0.3: IC1.1 35.42,67.88 33,67.88 v33,66
  Bottom 0.3: v33,66 33,63.38 28.25,58.62 28.25,57.75 INPUT_SW.3
  Bottom 0.508: R3.2 27.32,56.64 INPUT_SW.3
N$9  (via drill 0.3)
  Top 0.3: v48.62,78.5 48.62,67 47.25,67 IC1.32 | v45.12,82 45.12,85.75 40,90.88 27,90.88 LED3_GREEN.A
  Bottom 0.3: v45.12,82 v48.62,78.5
N$10
  Top 0.508: IC1.30 54.24,65.33 56.07,63.5 Q1.2
  Bottom 0.508: Q1.2 C2.1
N$11
  Top 0.508: IC1.31 49.38,66.13 51.83,68.58 Q1.1
  Bottom 0.508: Q1.1 C1.1
N$12
  Top 0.3: 44.57,50.07 IC1.21
  Top 0.508: PROGRAMMER_CONN.4 43.51,47.74 43.5,47.75 43.5,49 44.57,50.07
N$13
  Bottom 0.508: R4.1 30.58,93.71 LED3_GREEN.K
N$14  (via drill 0.3)
  Top 0.3: IC1.15 39.77,55.77 37.75,53.75 37.75,50.5 36.75,49.5 34.25,49.5 34.25,49.25 v31.88,46.88 | v49.75,15 38.12,15 38.12,19.12 37.62,19.62 34,19.62 v34,21.88
  Bottom 0.3: v49.75,15 49.75,16.5 R1.2 | v34,21.88 34,22.75 26.88,29.88 26.88,39.62 28.62,41.38 28.62,44.62 30.88,46.88 v31.88,46.88
N$15  (via drill 0.3)
  Top 0.3: v47.38,70 47.38,67.88 47.25,67.75 IC1.33 | LED4_RED.A 41.38,5.12 41.38,2 70.5,2 71,2.5 71,5.12 73.75,7.88 73.75,22.88 72,24.62 72,55.25 63.75,63.5 63.75,73.25 v63.25,73.75
  Bottom 0.3: v47.38,70 53.88,70 57.62,73.75 v63.25,73.75
N$16  (via drill 0.3)
  Top 0.3: v46.38,68.75 45.88,69.25 45.62,69.25 45.38,69.5 IC1.34 | v61.25,72.75 61.25,92.56 RGB_LED.4
  Bottom 0.3: v46.38,68.75 46.5,68.62 53.75,68.62 57.88,72.75 v61.25,72.75
N$17
  Bottom 0.508: LED1.A 42.58,14 47.25,14 47.95,14.7 R1.1
N$18  (via drill 0.3)
  Top 0.3: v45.62,65.75 45.62,67.62 44.62,68.62 44.62,69.5 IC1.35 | v56.12,66.25 57.25,67.38 60.25,67.38 60.25,89.77 57.77,92.25 RGB_LED.3
  Bottom 0.3: v45.62,65.75 55.62,65.75 v56.12,66.25
N$19
  Bottom 0.508: R5.2 13.83,33.95 D9.C
N$20
  Top 0.3: IC1.36 43.88,69.62 43.88,70.88 46.12,73.12 46.12,86.25 51.25,91.38 54.88,91.38 54.88,93.25 55.12,93.5 RGB_LED.2
N$21
  Top 0.3: IC1.11 35.55,59.75 35,59.75 33,57.75 32.5,57.75 29.71,54.96 FREE_PINS1.3
N$22
  Top 0.3: IC1.42 38.97,71.03 36,74 36,79.81
  Top 0.508: 36,79.81 FREE_PINS2.1
N$23
  Top 0.3: IC1.41 39.77,71.73 38,73.5 38,79.27 FREE_PINS2.2
N$24
  Top 0.3: IC1.38 42.17,72.17 43,73 43,77.5 41.27,79.23
  Top 0.508: 41.27,79.23 FREE_PINS2.3
N$25
  Bottom 0.3: R6.1 47.88,10.75 44.12,10.75 38.62,5.25 LED4_RED.K
N$26
  Top 0.3: IC1.37 42.97,71.22 44,72.25 44,79.81
  Top 0.508: 44,79.81 FREE_PINS2.4
N$27
  Top 0.3: IC1.12 35.19,55.75
  Top 0.508: 35.19,55.75 33.75,55.75 32.25,54.25 FREE_PINS1.2
N$28
  Top 0.3: IC1.13 38.17,56.92 34.79,53.54
  Top 0.508: 34.79,53.54 FREE_PINS1.1
PWM_1_RIGHT_MOTOR  (via drill 0.3)
  Top 0.3: v48.38,56.88 50,55.25 50,32.38 42.12,32.38 41.5,31.75 41.5,20.23 43.31,18.41 IC2.9 | v41.62,60.5 40.75,59.62 39,59.62 39,58.12 IC1.14
  Bottom 0.3: v48.38,56.88 44.75,60.5 v41.62,60.5
PWM_2_LEFT_MOTOR  (via drill 0.3)
  Top 0.3: v39.25,60.88 39.25,64.38 36.75,66.88 35.62,66.88 IC1.2 | v29.62,50.88 v29.62,43.88 | v28.62,32.88 34,32.88 34,34 IC2.1
  Bottom 0.3: v39.25,60.88 39.25,55 35.12,50.88 v29.62,50.88 | v29.62,43.88 29.62,40.12 27.75,38.25 27.75,33.75 v28.62,32.88
RESET  (via drill 0.3, 0.5)
  Top 0.3: v40.75,48.25 43.25,50.75 43.25,55.5 42.17,56.58 IC1.18 | 15.75,28.5 v15.75,30
  Top 0.508: RESET.1 26.49,32.75 21.25,32.75 17,28.5 15.75,28.5
  Bottom 0.3: v15.75,30 15.75,28.5 R5.1
  Bottom 0.508: v40.75,48.25 36,48.25 35.88,48.13 PROGRAMMER_CONN.1 35.88,42.15 RESET.1
RM_ENC_CH_A  (via drill 0.5)
  Top 0.3: IC1.23 48.27,59.73
  Top 0.508: v66.75,25.25 66.75,54.75 53.25,54.75 48.27,59.73
  Bottom 0.508: v66.75,25.25 66.81,25.19 CON2.6
RM_ENC_CH_B  (via drill 0.5)
  Top 0.3: IC1.24 49.47,60.53
  Top 0.508: 49.47,60.53 53.75,56.25 69.5,56.25 v69.5,25.25
  Bottom 0.508: v69.5,25.25 69.5,17.89 CON2.5
RM_H_BRDG_DIR_1
  Top 0.3: IC1.26 47.12,62.12 45.75,62.12 45.75,59.38 47.38,57.75 47.38,37.25 43.88,33.75 IC2.15
RM_H_BRDG_DIR_2  (via drill 0.3)
  Top 0.3: IC1.25 47.22,61.38 49.88,61.38 52.75,58.5 v53.38,58.5 | v51,55.12 50.88,55 v50.88,27.88
  Bottom 0.3: v53.38,58.5 51,56.12 v51,55.12 | v50.88,27.88 43.88,20.88 IC2.10
RM_M+
  Top 1.016: IC2.14 45.38,31.11 54.05,22.45 61.8,22.45 61.85,22.5 72.5,22.5 72.5,14.5 70.66,12.66 CON2.1 69.35,3.84 D6.C D5.A
RM_M-
  Top 1.016: IC2.11 48.51,23.5 51.78,20.21 53,20.21 | 53,20.21 D7.C | CON2.2 66.11,11.96 D8.A 53,15.47 53,20.21
UART2_RX
  Top 0.3: IC1.44 29.75,77.15
  Top 0.508: UART_BT_CONN.3 UART_USB_CONN.3 26.88,77.25 29.75,77.25 29.75,77.15
UART2_TX
  Top 0.3: IC1.43 38.17,70.44 28.91,79.7
  Top 0.508: UART_BT_CONN.2 UART_USB_CONN.2 28.91,79.7
VCAP/VDDCORE
  Top 0.3: IC1.7 32.41,62.93 C3.+
VDD  (via drill 1)
  Top 0.508: C15.1 51.64,63.73 IC1.28 42.77,63.73 40.57,65.93 IC1.40 40.57,72.52 39.62,73.47 39.62,75.19 C16.1 | IC1.17 41.37,53.25 C14.1 41.55,52.05 38.42,48.92 PROGRAMMER_CONN.2
  Top 1.016: v55,58 55,62 53.13,63.87 C15.1 | PROGRAMMER_CONN.2 38.5,45.6 38.5,43 37.75,42.25 26.25,42.25 23.69,44.81 INPUT_SW.1 23.48,57.75 16.5,57.75 14,55.25 v14,41
  Bottom 0.3: +3.3V.2 58.5,25.25 58.5,25.17
  Bottom 1.016: IC4.3 54.95,46.76 C7.+ | CON2.4 65.8,15.2 65,16 61.05,16 C13.1 61,25.13 +3.3V.3 | +3.3V.3 58.5,25.17 +3.3V.2 +3.3V.1 | C7.+ 51.5,48.62 51.5,41 38.5,41 38.42,41.08 PROGRAMMER_CONN.2 | C7.+ 54.95,57.95 | 54.95,57.95 v55,58 | CON1.4 17.85,15.2 C9.1 18,15.95 18,35.5 15.64,37.86 D9.A 14.14,40.85 v14,41 | +3.3V.3 68,32.21 68,55 65.05,57.95 54.95,57.95

### Text on the board
tPlace: - B G R | JERRY / MicroMouse / 2020 | 1 | 1 | - S | 1 | 1 | +3.3V | +5V | 1 | +3.3V | GND | ENCODER | ENCODER
bPlace: JERRY / MicroMouse / 2020